# Altium schematic sheet [2] Power Budget.SchDoc
size A; SheetNumber: 2; SheetTotal: 4
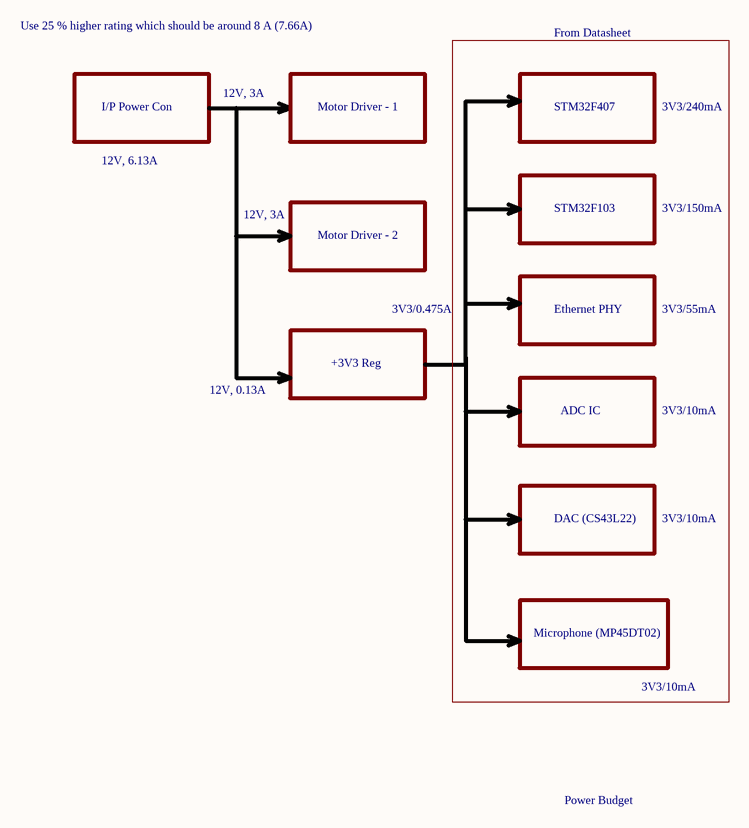
[diagram p0: [2] Power Budget.SchDoc]

## Notes on the sheet
- Use 25 % higher rating which should be around 8 A (7.66A)
- From Datasheet
- I/P Power Con
- 12V, 3A
- Motor Driver - 1
- STM32F407
- 3V3/240mA
- 12V, 6.13A
- STM32F103
- 3V3/150mA
- Motor Driver - 2
- 3V3/0.475A
- Ethernet PHY
- 3V3/55mA
- 12V, 0.13A
- +3V3 Reg
- ADC IC
- 3V3/10mA
- DAC (CS43L22)
- Microphone (MP45DT02)
- Power Budget